# Altium schematic sheet Scheme.SchDoc
size A
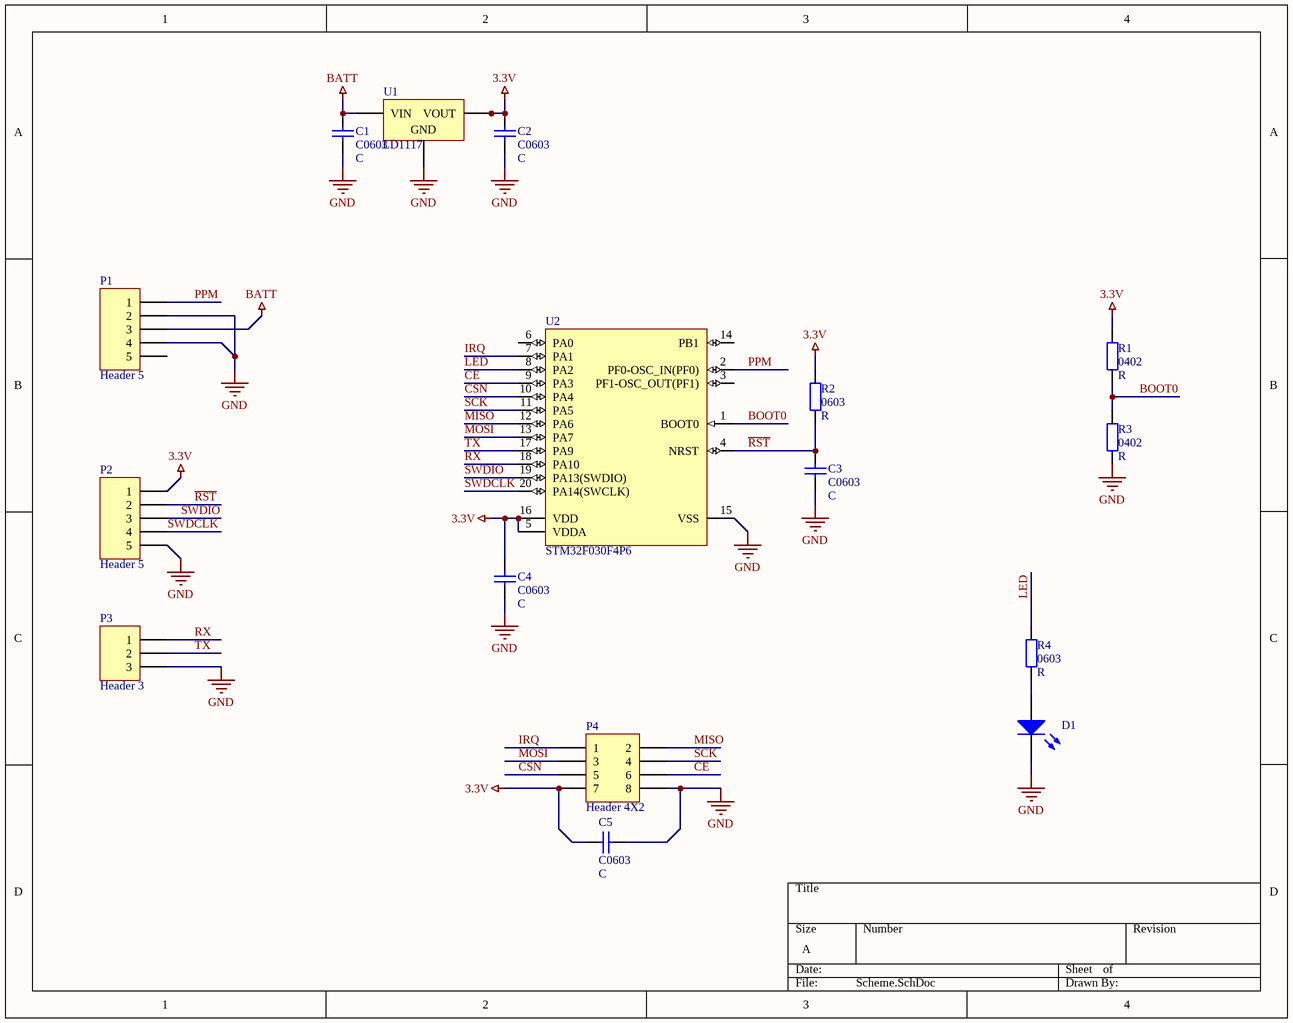
[diagram p0: Scheme.SchDoc]

## Parts
C1  C  [C0603]
C2  C  [C0603]
C3  C  [C0603]
C4  C  [C0603]
C5  C  [C0603]
D1  LEDX  [LED 0805 RED]  (value not drawn)
P1  Header 5  [HEADER 1X5 FEMALE]
P2  Header 5  [HEADER 1X5 FEMALE]
P3  Header 3  [HEADER 1X3 MALE]
P4  Header 4X2  [HEADER 2X4 FEMALE]
R1  R  [0402]
R2  R  [0603]
R3  R  [0402]
R4  R  [0603]
U1  LD1117  [TO-252]
U2  STM32F030F4P6  [SSOP20_M]

## Nets
3.3V: C2.2 C4.1 C5.1 P2.1 P4.7 R1.1 R2.1 U1.2(VOUT) U1.4(VOUT) U1.5(VOUT) U1.6(VOUT) U2.5(VDDA) U2.16(VDD)
BATT: C1.2 P1.3 U1.3(VIN)
GND: C1.1 C2.1 C3.2 C4.2 C5.2 D1.2(K) P1.2 P1.4 P2.5 P3.3 P4.8 R3.2 U1.1(GND) U2.15(VSS)
~{RST}: C3.1 P2.2 R2.2 U2.4(NRST)
BOOT0: R1.2 R3.1 U2.1(BOOT0)
CE: P4.6 U2.9(PA3)
CSN: P4.5 U2.10(PA4)
IRQ: P4.1 U2.7(PA1)
LED: R4.1 U2.8(PA2)
MISO: P4.2 U2.12(PA6)
MOSI: P4.3 U2.13(PA7)
PPM: P1.1 U2.2(PF0-OSC_IN(PF0))
RX: P3.1 U2.18(PA10)
SCK: P4.4 U2.11(PA5)
SWDCLK: P2.4 U2.20(PA14(SWCLK))
SWDIO: P2.3 U2.19(PA13(SWDIO))
TX: P3.2 U2.17(PA9)
NetD1_1: D1.1(A) R4.2

Not connected (* = marked no-connect by the designer): P1 5; U2 3(PF1-OSC_OUT(PF1)) 6(PA0) 14(PB1)

## Library data of the parts
C1-C5 = Cap: Generic capacitor; Packge: C0603; Value: C
D1 = LEDX: Typical LED
P1 P2 = Header 5: Header, 5-Pin; LatestRevisionDate: 17-Jul-2002; LatestRevisionNote: Re-released for DXP Platform.; Publisher: Altium Limited
P3 = Header 3: Header, 3-Pin; LatestRevisionDate: 17-Jul-2002; LatestRevisionNote: Re-released for DXP Platform.; Publisher: Altium Limited
P4 = Header 4X2: Header, 4-Pin, Dual row; LatestRevisionDate: 17-Jul-2002; LatestRevisionNote: Re-released for DXP Platform.; Publisher: Altium Limited
R1-R4 = Res: Generic resistor; Value: R
  R1 R3: Package: 0402
  R2 R4: Package: 0603
U1 = LD1117: Low drop positive voltage regulator; pin to pad: 2>4 5>4 6>4; ComponentLink1URL: http://www.st.com/web/en/resource/technical/document/datasheet/CD00000544.pdf; ComponentLink1Description: Datasheet
U2 = STM32F030F4P6: ARM Cortex-M0 32-bit MCU, 16 KB Flash, 4 KB Internal RAM, 15 I/Os, 20-pin TSSOP, -40 to 85 degC, Tube; FLASH Size (Prog) (kB): 16; I/Os (High Current): 15; Internal RAM Size (kB): 4; Operating Frequency(F) (Processor speed) (MHz): 48; Supply Voltage(Vcc) min (V): 2.4; DatasheetVersion: Rev. 1; PackageVersion: Rev. 1, 11/2012; PackageReference: TSSOP20; PackageDescription: 20-Pin Thin Shrink Small Outline Package, 6.5 x 4.4 mm Body, 0.65 mm Pitch; Supplier 1: Digi-Key; Supplier Part Number 1: 497-14044-5-ND; Supplier 2: Newark; Supplier Part Number 2: 06X3648; Supplier 3: Mouser; Supplier Part Number 3: 511-STM32F030F4P6; Core: ARM Cortex-M0; Packing: Tube; Mounting Technology: Surface Mount; PartNumber: STM32F030F4P6; ComponentLink1Description: Manufacturer URL; ComponentLink1URL: http://www.st.com/web/en/home.html; ComponentLink2Description: Datasheet; ComponentLink2URL: http://www.st.com/st-web-ui/static/active/en/resource/technical/document/datasheet/DM00088500.pdf; ComponentLink3Description: Package Specification; ComponentLink3URL: http://www.st.com/st-web-ui/static/active/en/resource/technical/document/datasheet/DM00065136.pdf